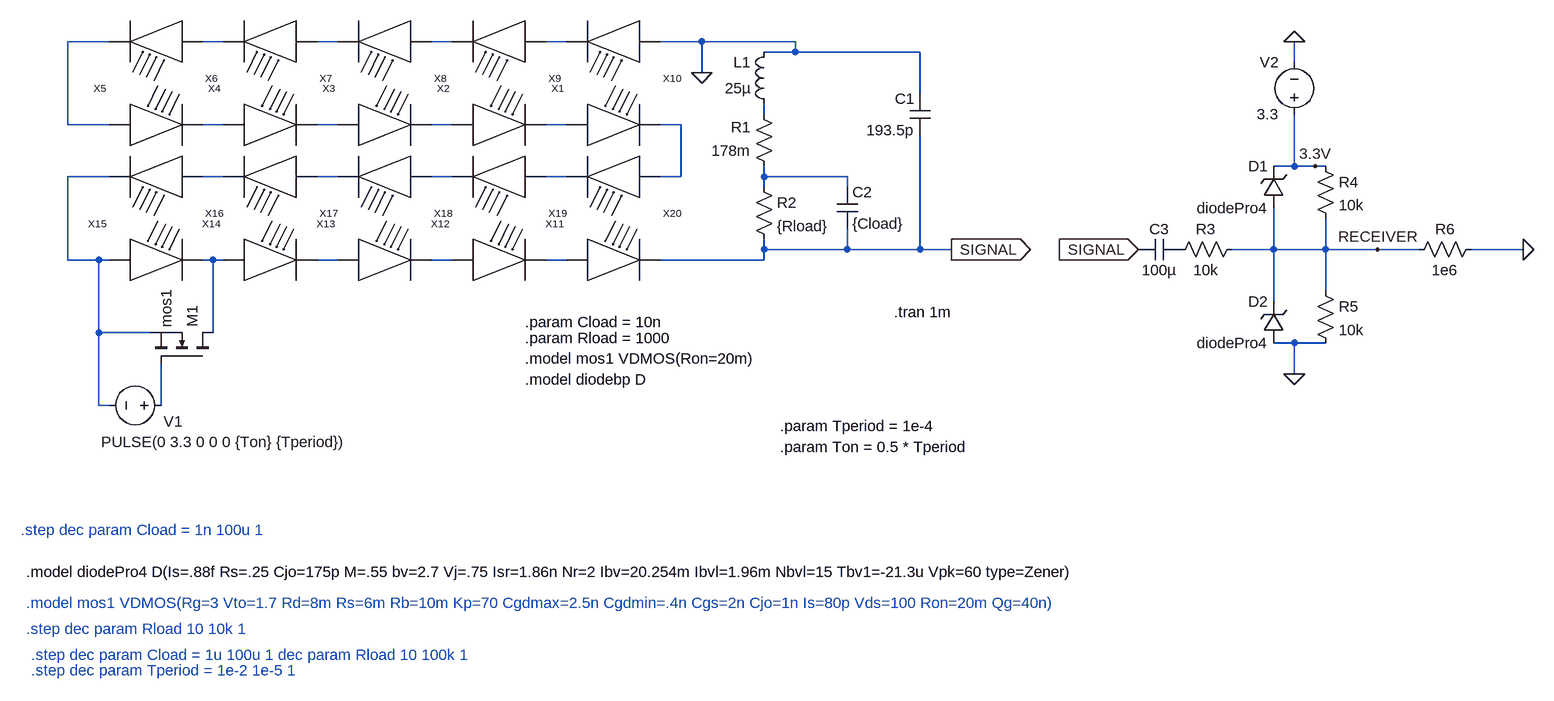
[diagram p0: schematic string.asc]
string.asc, the LTspice schematic file:
Version 4
SHEET 1 1588 684
WIRE -1088 -576 -1152 -576
WIRE -912 -576 -944 -576
WIRE -736 -576 -768 -576
WIRE -560 -576 -592 -576
WIRE -384 -576 -416 -576
WIRE -176 -576 -240 -576
WIRE -32 -576 -176 -576
WIRE -32 -560 -32 -576
WIRE -32 -560 -80 -560
WIRE 160 -560 -32 -560
WIRE 736 -544 736 -576
WIRE -176 -528 -176 -576
WIRE 160 -496 160 -560
WIRE -80 -464 -80 -480
WIRE -1152 -448 -1152 -576
WIRE -1088 -448 -1152 -448
WIRE -912 -448 -944 -448
WIRE -736 -448 -768 -448
WIRE -560 -448 -592 -448
WIRE -384 -448 -416 -448
WIRE -208 -448 -240 -448
WIRE 736 -384 736 -464
WIRE 736 -384 704 -384
WIRE 768 -384 736 -384
WIRE 784 -384 768 -384
WIRE -1088 -368 -1152 -368
WIRE -912 -368 -944 -368
WIRE -736 -368 -768 -368
WIRE -560 -368 -592 -368
WIRE -384 -368 -416 -368
WIRE -208 -368 -208 -448
WIRE -208 -368 -240 -368
WIRE -80 -368 -80 -384
WIRE 48 -368 -80 -368
WIRE -80 -352 -80 -368
WIRE 48 -352 48 -368
WIRE -80 -256 -80 -272
WIRE 48 -256 48 -288
WIRE 48 -256 -80 -256
WIRE 160 -256 160 -432
WIRE 160 -256 48 -256
WIRE 208 -256 160 -256
WIRE 704 -256 704 -320
WIRE 704 -256 640 -256
WIRE 784 -256 784 -304
WIRE 784 -256 704 -256
WIRE 864 -256 784 -256
WIRE 928 -256 864 -256
WIRE 1088 -256 1008 -256
WIRE -1152 -240 -1152 -368
WIRE -1104 -240 -1152 -240
WIRE -1088 -240 -1104 -240
WIRE -928 -240 -944 -240
WIRE -912 -240 -928 -240
WIRE -736 -240 -768 -240
WIRE -560 -240 -592 -240
WIRE -384 -240 -416 -240
WIRE -80 -240 -80 -256
WIRE -80 -240 -240 -240
WIRE 784 -192 784 -256
WIRE 704 -176 704 -256
WIRE -1104 -128 -1104 -240
WIRE -1024 -128 -1104 -128
WIRE -928 -128 -928 -240
WIRE 736 -112 704 -112
WIRE 784 -112 736 -112
WIRE 736 -64 736 -112
WIRE -1104 -16 -1104 -128
WIRE -1088 -16 -1104 -16
WIRE -1008 -16 -1008 -80
FLAG 208 -256 SIGNAL
IOPIN 208 -256 Out
FLAG -176 -528 0
FLAG 1088 -256 0
FLAG 864 -256 RECEIVER
FLAG 736 -64 0
FLAG 768 -384 3.3V
FLAG 736 -576 0
FLAG 496 -256 SIGNAL
IOPIN 496 -256 In
SYMBOL jacModule -304 -576 R180
SYMATTR InstName X1
SYMBOL jacModule -480 -576 R180
SYMATTR InstName X2
SYMBOL jacModule -656 -576 R180
SYMATTR InstName X3
SYMBOL jacModule -832 -576 R180
SYMATTR InstName X4
SYMBOL jacModule -1008 -576 R180
SYMATTR InstName X5
SYMBOL jacModule -1024 -448 R0
SYMATTR InstName X6
SYMBOL jacModule -848 -448 R0
SYMATTR InstName X7
SYMBOL jacModule -672 -448 R0
SYMATTR InstName X8
SYMBOL jacModule -496 -448 R0
SYMATTR InstName X9
SYMBOL jacModule -320 -448 R0
SYMATTR InstName X10
SYMBOL jacModule -304 -368 R180
SYMATTR InstName X11
SYMBOL jacModule -480 -368 R180
SYMATTR InstName X12
SYMBOL jacModule -656 -368 R180
SYMATTR InstName X13
SYMBOL jacModule -832 -368 R180
SYMATTR InstName X14
SYMBOL jacModule -1008 -368 R180
SYMATTR InstName X15
SYMBOL jacModule -1024 -240 R0
SYMATTR InstName X16
SYMBOL jacModule -848 -240 R0
SYMATTR InstName X17
SYMBOL jacModule -672 -240 R0
SYMATTR InstName X18
SYMBOL jacModule -496 -240 R0
SYMATTR InstName X19
SYMBOL jacModule -320 -240 R0
SYMATTR InstName X20
SYMBOL cap 176 -432 R180
WINDOW 0 24 56 Left 2
WINDOW 3 24 8 Left 2
SYMATTR InstName C1
SYMATTR Value 193.5p
SYMBOL ind -64 -464 R180
WINDOW 0 36 80 Left 2
WINDOW 3 36 40 Left 2
SYMATTR InstName L1
SYMATTR Value 25µ
SYMBOL res -64 -368 R180
WINDOW 0 36 76 Left 2
WINDOW 3 36 40 Left 2
SYMATTR InstName R1
SYMATTR Value 178m
SYMBOL nmos -928 -80 M270
SYMATTR InstName M1
SYMATTR Value mos1
SYMBOL voltage -992 -16 M270
WINDOW 0 -25 12 VLeft 2
WINDOW 3 -56 -272 VRight 2
WINDOW 123 0 0 Left 2
WINDOW 39 0 0 Left 2
SYMATTR InstName V1
SYMATTR Value PULSE(0 3.3 0 0 0 {Ton} {Tperiod})
SYMBOL res -96 -368 R0
SYMATTR InstName R2
SYMATTR Value {Rload}
SYMBOL cap 32 -352 R0
SYMATTR InstName C2
SYMATTR Value {Cload}
SYMBOL cap 560 -272 R90
WINDOW 0 0 32 VBottom 2
WINDOW 3 32 32 VTop 2
SYMATTR InstName C3
SYMATTR Value 100µ
SYMBOL res 656 -272 R90
WINDOW 0 0 56 VBottom 2
WINDOW 3 32 56 VTop 2
SYMATTR InstName R3
SYMATTR Value 10k
SYMBOL zener 720 -320 R180
WINDOW 0 24 64 Left 2
WINDOW 3 24 0 Left 2
SYMATTR InstName D1
SYMATTR Value diodePro4
SYMATTR Description Diode
SYMATTR Type diode
SYMBOL zener 720 -112 R180
WINDOW 0 24 64 Left 2
WINDOW 3 24 0 Left 2
SYMATTR InstName D2
SYMATTR Value diodePro4
SYMATTR Description Diode
SYMATTR Type diode
SYMBOL res 768 -400 R0
SYMATTR InstName R4
SYMATTR Value 10k
SYMBOL res 768 -208 R0
SYMATTR InstName R5
SYMATTR Value 10k
SYMBOL res 1024 -272 R90
WINDOW 0 0 56 VBottom 2
WINDOW 3 32 56 VTop 2
SYMATTR InstName R6
SYMATTR Value 1e6
SYMBOL voltage 736 -448 R180
WINDOW 0 24 96 Left 2
WINDOW 3 24 16 Left 2
WINDOW 123 0 0 Left 2
WINDOW 39 0 0 Left 2
SYMATTR InstName V2
SYMATTR Value 3.3
TEXT 120 -160 Left 2 !.tran 1m
TEXT -448 -120 Left 2 !.param Rload = 1000
TEXT -448 -144 Left 2 !.param Cload = 10n
TEXT -448 -88 Left 2 !.model mos1 VDMOS(Ron=20m)
TEXT -1216 288 Left 2 ;.model mos1 VDMOS(Rg=3 Vto=1.7 Rd=8m Rs=6m Rb=10m Kp=70 Cgdmax=2.5n Cgdmin=.4n Cgs=2n Cjo=1n Is=80p Vds=100 Ron=20m Qg=40n)
TEXT -448 -56 Left 2 !.model diodebp D
TEXT -1208 368 Left 2 ;.step dec param Cload = 1u 100u 1 dec param Rload 10 100k 1
TEXT -1216 328 Left 2 ;.step dec param Rload 10 10k 1
TEXT -1224 176 Left 2 ;.step dec param Cload = 1n 100u 1
TEXT -56 48 Left 2 !.param Ton = 0.5 * Tperiod
TEXT -56 16 Left 2 !.param Tperiod = 1e-4
TEXT -1208 392 Left 2 ;.step dec param Tperiod = 1e-2 1e-5 1
TEXT -1216 240 Left 2 !.model diodePro4 D(Is=.88f Rs=.25 Cjo=175p M=.55 bv=2.7 Vj=.75 Isr=1.86n Nr=2 Ibv=20.254m Ibvl=1.96m Nbvl=15 Tbv1=-21.3u Vpk=60 type=Zener)

The netlist it stands for:
* string.asc
XX1 0 N005 jacModule  ; pins modIN modOUT
XX2 N005 N004 jacModule  ; pins modIN modOUT
XX3 N004 N003 jacModule  ; pins modIN modOUT
XX4 N003 N002 jacModule  ; pins modIN modOUT
XX5 N002 N001 jacModule  ; pins modIN modOUT
XX6 N001 N007 jacModule  ; pins modIN modOUT
XX7 N007 N008 jacModule  ; pins modIN modOUT
XX8 N008 N009 jacModule  ; pins modIN modOUT
XX9 N009 N010 jacModule  ; pins modIN modOUT
XX10 N010 N011 jacModule  ; pins modIN modOUT
XX11 N011 N016 jacModule  ; pins modIN modOUT
XX12 N016 N015 jacModule  ; pins modIN modOUT
XX13 N015 N014 jacModule  ; pins modIN modOUT
XX14 N014 N013 jacModule  ; pins modIN modOUT
XX15 N013 N012 jacModule  ; pins modIN modOUT
XX16 N012 N018 jacModule  ; pins modIN modOUT
XX17 N018 N019 jacModule  ; pins modIN modOUT
XX18 N019 N020 jacModule  ; pins modIN modOUT
XX19 N020 N021 jacModule  ; pins modIN modOUT
XX20 N021 SIGNAL jacModule  ; pins modIN modOUT
C1 SIGNAL 0 193.5p
L1 N006 0 25µ
R1 N017 N006 178m
M1 N018 N022 N012 N012 mos1
V1 N022 N012 PULSE(0 3.3 0 0 0 {Ton} {Tperiod})
R2 N017 SIGNAL {Rload}
C2 N017 SIGNAL {Cload}
C3 P001 SIGNAL 100µ
R3 RECEIVER P001 10k
D1 RECEIVER 3.3V diodePro4
D2 0 RECEIVER diodePro4
R4 3.3V RECEIVER 10k
R5 RECEIVER 0 10k
R6 0 RECEIVER 1e6
V2 3.3V 0 3.3
.model D D
.lib standard.dio
.model NMOS NMOS
.model PMOS PMOS
.lib standard.mos
.tran 1m
.param Rload = 1000
.param Cload = 10n
.model mos1 VDMOS(Ron=20m)
* .model mos1 VDMOS(Rg=3 Vto=1.7 Rd=8m Rs=6m Rb=10m Kp=70 Cgdmax=2.5n Cgdmin=.4n Cgs=2n Cjo=1n Is=80p Vds=100 Ron=20m Qg=40n)
.model diodebp D
* .step dec param Cload = 1u 100u 1 dec param Rload 10 100k 1
* .step dec param Rload 10 10k 1
* .step dec param Cload = 1n 100u 1
.param Ton = 0.5 * Tperiod
.param Tperiod = 1e-4
* .step dec param Tperiod = 1e-2 1e-5 1
.model diodePro4 D(Is=.88f Rs=.25 Cjo=175p M=.55 bv=2.7 Vj=.75 Isr=1.86n Nr=2 Ibv=20.254m Ibvl=1.96m Nbvl=15 Tbv1=-21.3u Vpk=60 type=Zener)
.backanno
.end